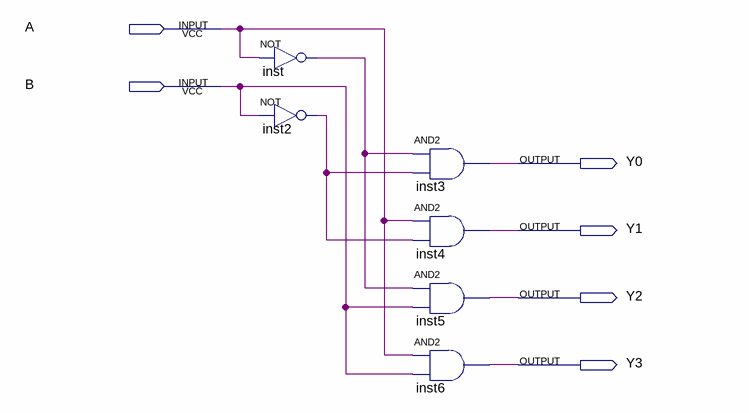
[diagram p0: schematic sheet]
// Quartus schematic Decodificator_de_adresa.bdf as structural Verilog: 6 symbols, 6 pins
module Decodificator_de_adresa (
  input  A,
  input  B,
  output Y0,
  output Y1,
  output Y2,
  output Y3
);

  wire inst2_out, inst_out;

  not inst (inst_out, A);
  not inst2 (inst2_out, B);
  and inst3 (Y0, inst_out, inst2_out);
  and inst4 (Y1, A, inst2_out);
  and inst5 (Y2, inst_out, B);
  and inst6 (Y3, A, B);
endmodule
